# EAGLE design vest (EAGLE 6.5.0)
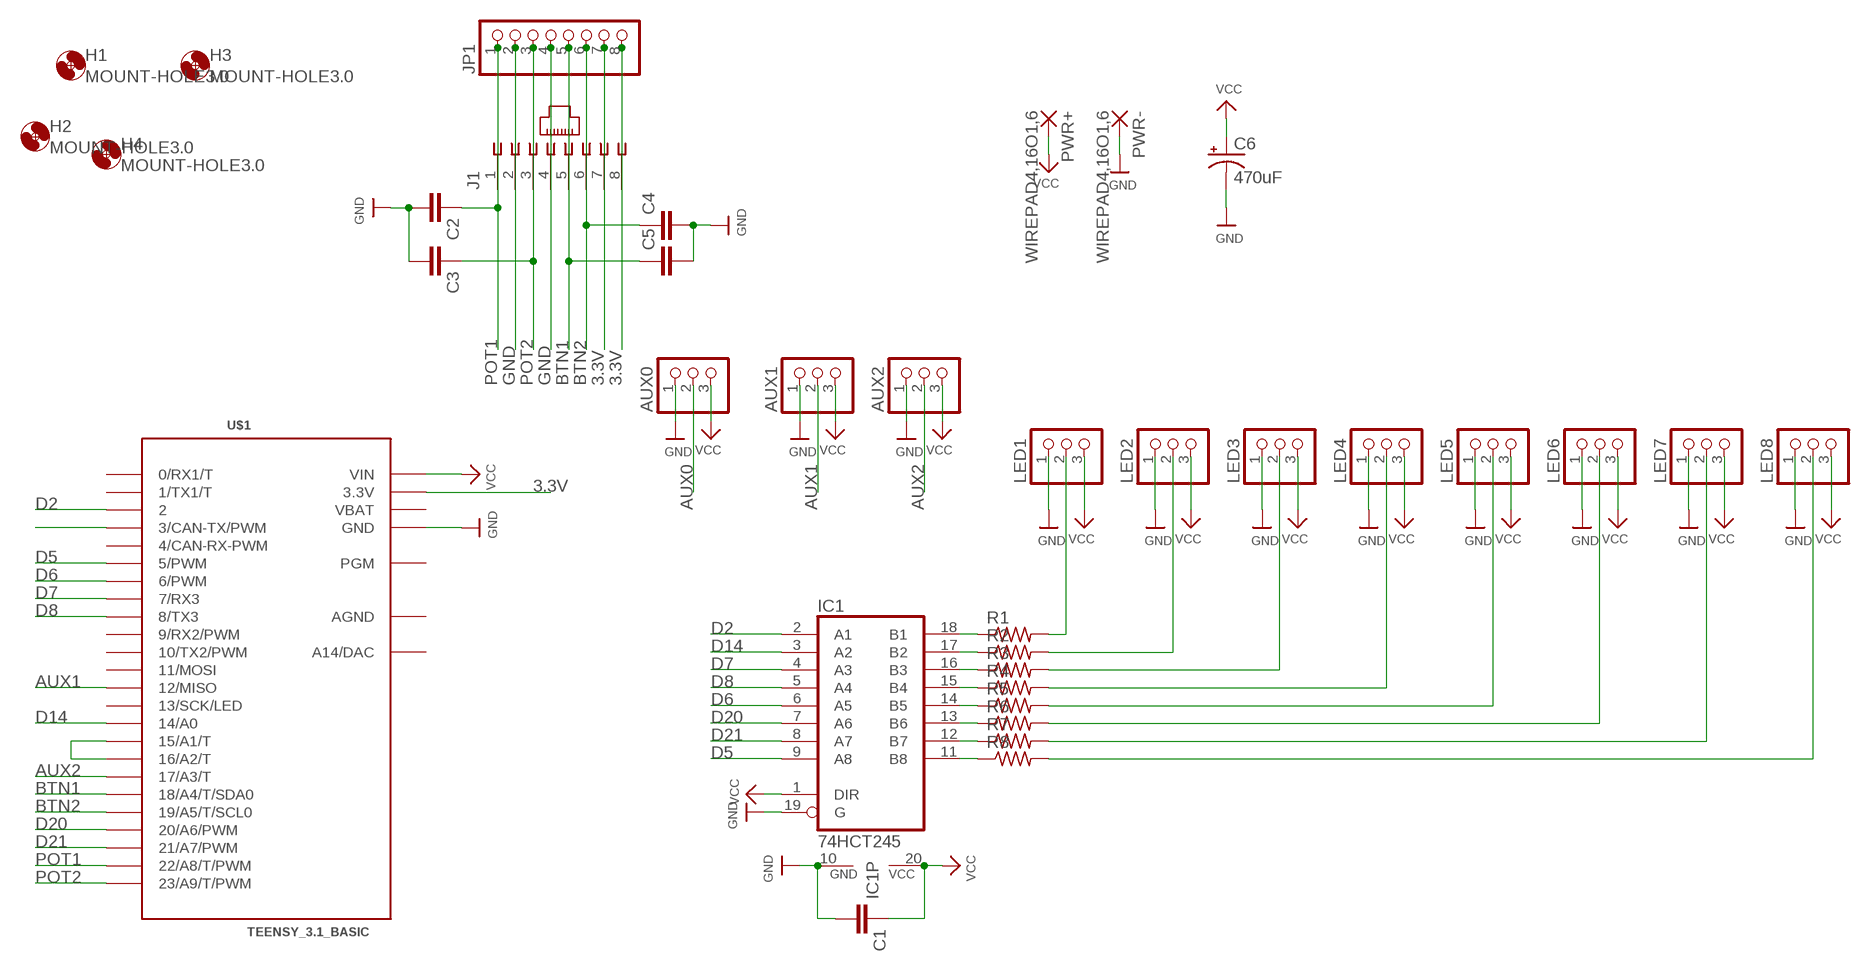
[diagram p0: schematic, sheet 1]

## Parts
AUX0  HEADER-1X3  [1X03_OVAL]
AUX1  HEADER-1X3  [1X03_OVAL]
AUX2  HEADER-1X3  [1X03_OVAL]
C1  C-EU025-025X050  [C025-025X050]
C2  C-EU025-025X050  [C025-025X050]
C3  C-EU025-025X050  [C025-025X050]
C4  C-EU025-025X050  [C025-025X050]
C5  C-EU025-025X050  [C025-025X050]
C6  470uF  CPOL-USTT2D7L  [TT2D7L]
H1  MOUNT-HOLE3.0  [3,0]
H2  MOUNT-HOLE3.0  [3,0]
H3  MOUNT-HOLE3.0  [3,0]
H4  MOUNT-HOLE3.0  [3,0]
IC1  74HCT245  74AC245N  [DIL20]
J1  215877-4  [215877-4]
JP1  HEADER-1X870MIL  [1X08_ROUND_70]
LED1  HEADER-1X3  [1X03_OVAL]
LED2  HEADER-1X3  [1X03_OVAL]
LED3  HEADER-1X3  [1X03_OVAL]
LED4  HEADER-1X3  [1X03_OVAL]
LED5  HEADER-1X3  [1X03_OVAL]
LED6  HEADER-1X3  [1X03_OVAL]
LED7  HEADER-1X3  [1X03_OVAL]
LED8  HEADER-1X3  [1X03_OVAL]
PWR+  WIREPAD4,16O1,6  [4,16O1,6]
PWR-  WIREPAD4,16O1,6  [4,16O1,6]
R1  R-US_0204/7  [0204/7]
R2  R-US_0204/7  [0204/7]
R3  R-US_0204/7  [0204/7]
R4  R-US_0204/7  [0204/7]
R5  R-US_0204/7  [0204/7]
R6  R-US_0204/7  [0204/7]
R7  R-US_0204/7  [0204/7]
R8  R-US_0204/7  [0204/7]
U$1  TEENSY_3.1_BASIC  [TEENSY_3.1_BASIC]

## Nets
3.3V: J1.7 J1.8 JP1.7 JP1.8 U$1.3.3V U$1.3.3V1(3.3V)
AUX0: AUX0.2 U$1.3(3/CAN-TX/PWM)
AUX1: AUX1.2 U$1.12(12/MISO)
AUX2: AUX2.2 U$1.17/A3(17/A3/T)
BTN1: C5.1 J1.5 JP1.5 U$1.18/A4(18/A4/T/SDA0)
BTN2: C4.1 J1.6 JP1.6 U$1.19/A5(19/A5/T/SCL0)
D2: IC1.2(A1) U$1.2
D5: IC1.9(A8) U$1.5(5/PWM)
D6: IC1.6(A5) U$1.6(6/PWM)
D7: IC1.4(A3) U$1.7(7/RX3)
D8: IC1.5(A4) U$1.8(8/TX3)
D14: IC1.3(A2) U$1.14/A0
D20: IC1.7(A6) U$1.20/A6(20/A6/PWM)
D21: IC1.8(A7) U$1.21/A7(21/A7/PWM)
GND: AUX0.1 AUX1.1 AUX2.1 C1.2 C2.2 C3.2 C4.2 C5.2 C6.- IC1.10(GND) IC1.19(G) J1.2 J1.4 JP1.2 JP1.4 LED1.1 LED2.1 LED3.1 LED4.1 LED5.1 LED6.1 LED7.1 LED8.1 PWR-.1(P) U$1.GND U$1.GND1(GND)
N$1: U$1.15/A1(15/A1/T) U$1.16/A2(16/A2/T)
N$2: IC1.11(B8) R8.1
N$3: IC1.18(B1) R1.1
N$4: IC1.17(B2) R2.1
N$5: IC1.16(B3) R3.1
N$6: IC1.15(B4) R4.1
N$7: IC1.14(B5) R5.1
N$8: IC1.13(B6) R6.1
N$9: IC1.12(B7) R7.1
N$10: LED1.2 R1.2
N$11: LED2.2 R2.2
N$12: LED3.2 R3.2
N$13: LED4.2 R4.2
N$14: LED5.2 R5.2
N$15: LED6.2 R6.2
N$16: LED7.2 R7.2
N$17: LED8.2 R8.2
POT1: C2.1 J1.1 JP1.1 U$1.22/A8(22/A8/T/PWM)
POT2: C3.1 J1.3 JP1.3 U$1.23/A9(23/A9/T/PWM)
VCC: AUX0.3 AUX1.3 AUX2.3 C1.1 C6.+ IC1.1(DIR) IC1.20(VCC) LED1.3 LED2.3 LED3.3 LED4.3 LED5.3 LED6.3 LED7.3 LED8.3 PWR+.1(P) U$1.VIN
Unconnected: U$1.0(0/RX1/T) U$1.1(1/TX1/T) U$1.4(4/CAN-RX-PWM) U$1.9(9/RX2/PWM) U$1.10(10/TX2/PWM) U$1.11(11/MOSI) U$1.13(13/SCK/LED) U$1.A14(A14/DAC) U$1.PGM

## Power pins joined to a net without a drawn wire
AGND: U$1.AGND
VBAT: U$1.VBAT

## Library data of the parts
AUX0 AUX1 AUX2 LED1-LED8 = microbuilder:HEADER-1X3: PIN HEADER
C1-C5 = rcl:C-EU: CAPACITOR, European symbol
C6 = rcl:CPOL-US: POLARIZED CAPACITOR, American symbol
H1-H4 = holes:MOUNT-HOLE: MOUNTING HOLE with drill center marker
IC1 = 74xx-eu:74*245: Octal BUS TRANSCEIVER, 3-state
J1 = con-amp:215877-4: AMP connector
JP1 = microbuilder:HEADER-1X8: PIN HEADER
PWR+ PWR- = wirepad:WIREPAD: Wire PAD connect wire on PCB
R1-R8 = rcl:R-US_: RESISTOR, American symbol
U$1 = Teensy_3_Series_Board_v1.0:TEENSY_3.1_BASIC: Footprint for Teensy 3.1 board using all pin connections on the outer perimeter

## Net classes
0 default: width 0.406 mm

## Board
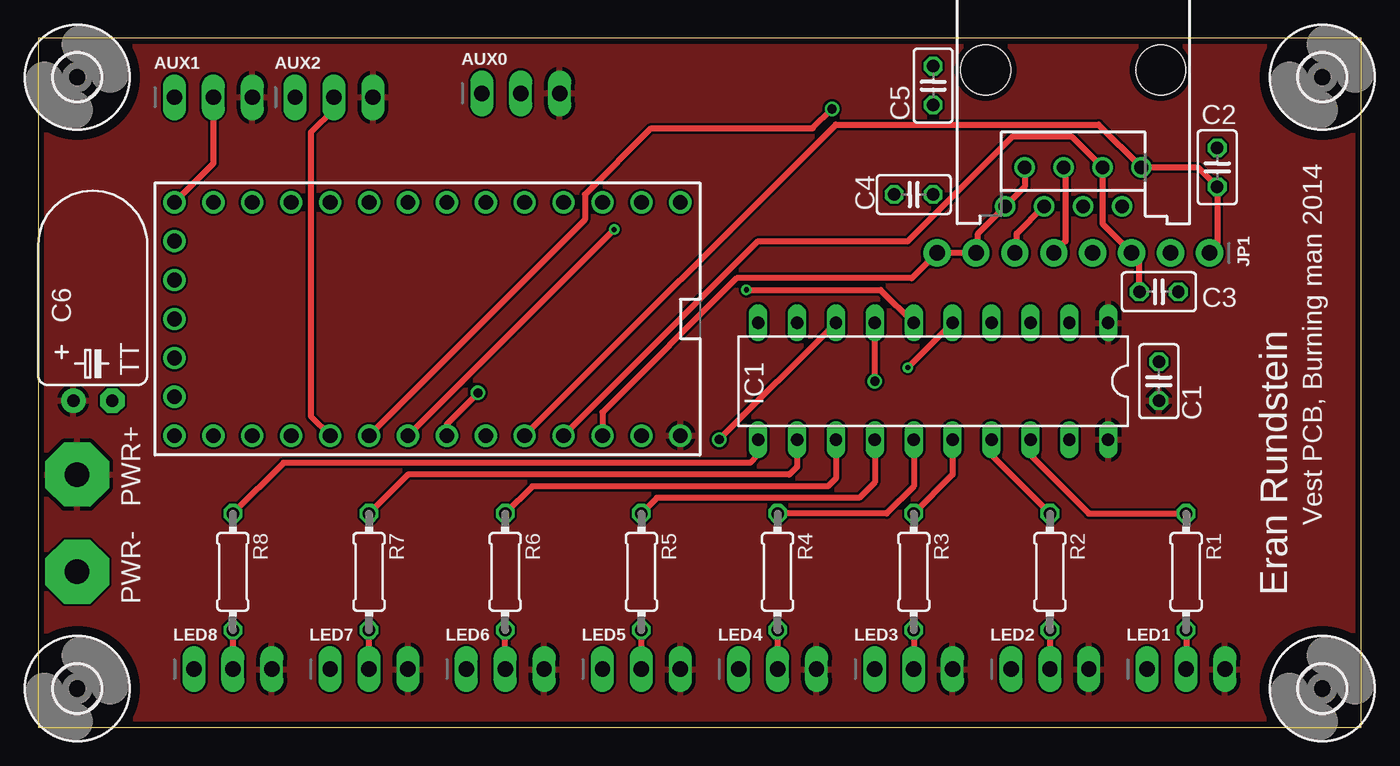
[diagram p1: board, top side]
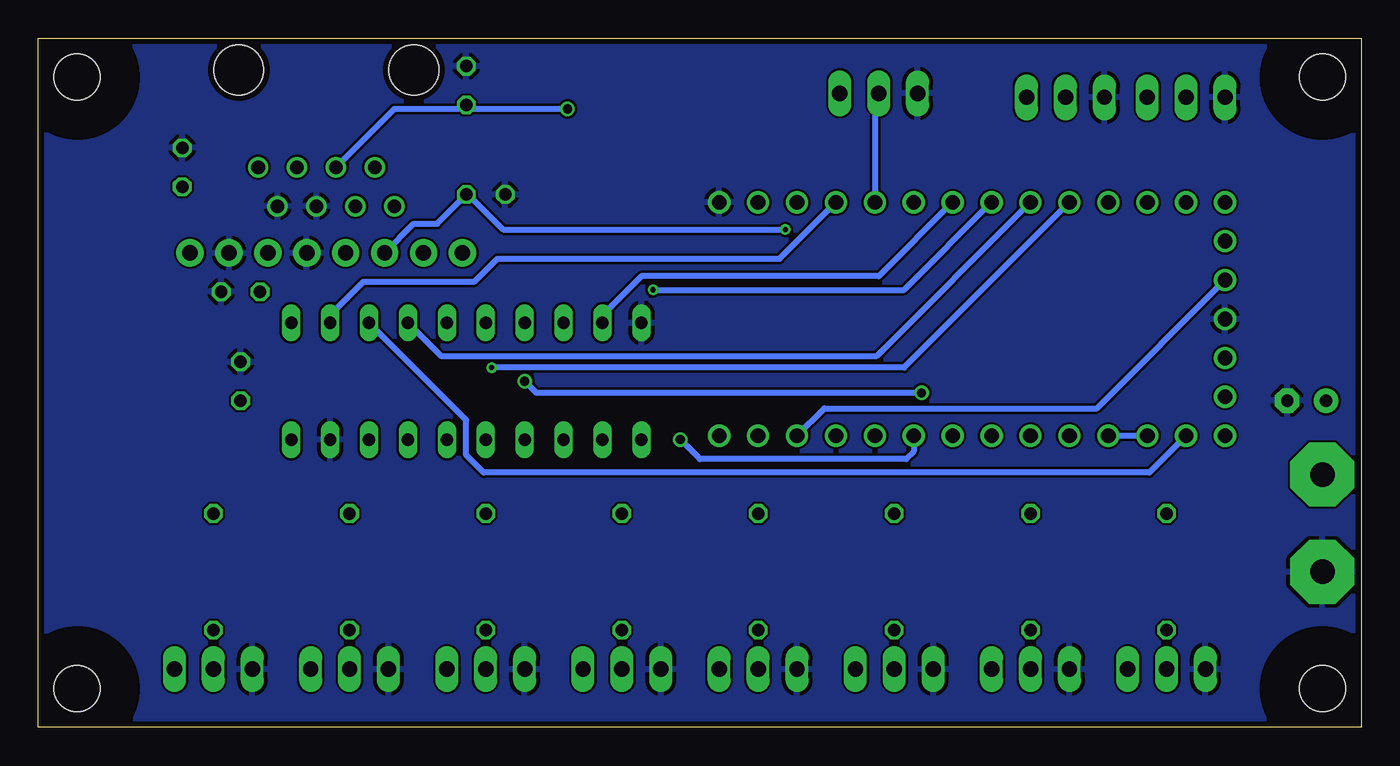
[diagram p2: board, bottom side, seen from below]

Size 86.36 x 45 mm. Coordinates in mm from the lower left corner, seen from the top.
Outline: 0,0 86.36,0 86.36,45 0,45 0,0
Copper layers (1*16): Top 0.0356mm / dielectric 1.5011mm / Bottom 0.0356mm
Design rules "oshpark_2layer": minimum track width 6mil, minimum drill 13mil, track to track 6mil, track to pad 6mil, pad to pad 6mil, via to via 6mil, smd to smd 6mil, copper to edge 15mil, drill to drill 6mil, minimum pad ring 7mil, minimum via ring 7mil, stop-mask expansion 3mil, vias tented up to drill 0mil, thermal gap 10mil

### Footprints (pad centres in the part's own frame; a part is rotated, then mirrored left to right if it is on the bottom)
1X03_OVAL = drill 1 long: 1 -2.54,0; 2 0,0; 3 2.54,0
C025-025X050 = drill 0.813 octagon: 1 -1.27,0; 2 1.27,0
TT2D7L = drill 0.813 pad 1.6: + -1.27,0 | drill 0.813 pad 1.6 octagon: - 1.27,0
3,0 = hole 3: 0,0
DIL20 = drill 0.813 long: 1 -11.43,-3.81; 2 -8.89,-3.81; 3 -6.35,-3.81; 4 -3.81,-3.81; 5 -1.27,-3.81; 6 1.27,-3.81; 7 3.81,-3.81; 8 6.35,-3.81; 9 8.89,-3.81; 10 11.43,-3.81; 11 11.43,3.81; 12 8.89,3.81; 13 6.35,3.81; 14 3.81,3.81; 15 1.27,3.81; 16 -1.27,3.81; 17 -3.81,3.81; 18 -6.35,3.81; 19 -8.89,3.81; 20 -11.43,3.81
215877-4 = drill 0.889: 1 -4.445,6.35; 2 -3.175,8.89; 3 -1.905,6.35; 4 -0.635,8.89; 5 0.635,6.35; 6 1.905,8.89; 7 3.175,6.35; 8 4.445,8.89 | hole 3.251: -5.715,0; 5.715,0
1X08_ROUND_70 = drill 1 pad 1.778: 1 -8.89,0; 2 -6.35,0; 3 -3.81,0; 4 -1.27,0; 5 1.27,0; 6 3.81,0; 7 6.35,0; 8 8.89,0
4,16O1,6 = drill 1.6 pad 4.166 octagon: 1 0,0
0204/7 = drill 0.813 octagon: 1 -3.81,0; 2 3.81,0
TEENSY_3.1_BASIC = drill 0.965: 0 -7.62,13.97; 1 -7.62,11.43; 2 -7.62,8.89; 3 -7.62,6.35; 3.3V 7.62,11.43; 3.3V1 -2.54,-16.51; 4 -7.62,3.81; 5 -7.62,1.27; 6 -7.62,-1.27; 7 -7.62,-3.81; 8 -7.62,-6.35; 9 -7.62,-8.89; 10 -7.62,-11.43; 11 -7.62,-13.97; 12 -7.62,-16.51; 13 7.62,-16.51; 14/A0 7.62,-13.97; 15/A1 7.62,-11.43; 16/A2 7.62,-8.89; 17/A3 7.62,-6.35; 18/A4 7.62,-3.81; 19/A5 7.62,-1.27; 20/A6 7.62,1.27; 21/A7 7.62,3.81; 22/A8 7.62,6.35; 23/A9 7.62,8.89; A14 5.08,-16.51; AGND 7.62,13.97; GND -7.62,16.51; GND1 0,-16.51; PGM 2.54,-16.51; VBAT -5.08,-16.51; VIN 7.62,16.51

### Placement (x,y rotation side)
AUX0  31.5,41.4 0 top
AUX1  11.43,41.15 0 top
AUX2  19.3,41.15 0 top
C1  73.15,22.61 90 top
C2  76.96,36.58 90 top
C3  73.15,28.45 0 top
C4  57.15,34.8 180 top
C5  58.42,41.91 90 top
C6  3.56,21.34 0 top
H1  2.54,2.54 0 top
H2  83.82,42.46 0 top
H3  2.54,42.46 0 top
H4  83.82,2.54 0 top
IC1  58.42,22.61 180 top
J1  67.56,42.93 180 top
JP1  67.56,30.99 180 top
LED1  74.93,3.81 0 top
LED2  66.04,3.81 0 top
LED3  57.15,3.81 0 top
LED4  48.26,3.81 0 top
LED5  39.37,3.81 0 top
LED6  30.48,3.81 0 top
LED7  21.59,3.81 0 top
LED8  12.7,3.81 0 top
PWR+  2.54,16.51 0 top
PWR-  2.54,10.16 0 top
R1  74.93,10.16 270 top
R2  66.04,10.16 270 top
R3  57.15,10.16 270 top
R4  48.26,10.16 270 top
R5  39.37,10.16 270 top
R6  30.48,10.16 270 top
R7  21.59,10.16 270 top
R8  12.7,10.16 270 top
U$1  25.4,26.67 270 top

### Tracks (layer width: path | path; a pad name or v marks a point on that pad's centre or on a via)
3.3V
  Top 0.406: J1.7 64.39,35.31 J1.8 61.34,32.26 61.34,31.11 JP1.7 JP1.8 57.02,29.34 45.59,29.34 36.83,20.57 U$1.3.3V
  Bottom 0.406: U$1.3.3V1 17.27,20.83 35.05,20.83 U$1.3.3V
AUX0
  Bottom 0.406: AUX0.2 31.75,41.15 U$1.3
AUX1
  Top 0.406: U$1.12 11.43,36.83 AUX1.2
AUX2
  Top 0.406: U$1.17/A3 17.78,20.32 17.78,38.86 19.3,40.39 AUX2.2
BTN1  (via drill 0.6)
  Top 0.406: U$1.18/A4 35.69,33.15 35.69,34.8 40.01,39.12 50.55,39.12 v51.82,40.39 | JP1.5 67.06,31.75 67.06,36.45 J1.5
  Bottom 0.406: 65.28,38.23 J1.5 63.12,40.39 58.67,40.39 | v51.82,40.39 58.67,40.39 | C5.1 58.67,40.39
BTN2  (via drill 0.33)
  Top 0.406: J1.6 63.88,32.26 63.88,31.11 JP1.6 | v37.59,32.51 U$1.19/A5
  Bottom 0.406: JP1.6 61.85,32.89 60.33,32.89 C4.1 58.29,34.67 58.17,34.67 56.01,32.51 v37.59,32.51
D2
  Bottom 0.406: IC1.2 67.31,27.3 66.93,27.3 65.15,29.08 57.91,29.08 56.39,30.61 37.97,30.61 36.83,31.75 36.58,32 U$1.2
D5
  Bottom 0.406: IC1.9 49.53,27.3 49.15,27.3 46.99,29.46 31.5,29.46 U$1.5
D6  (via drill 0.33)
  Top 0.406: IC1.6 54.99,28.57 v46.23,28.57
  Bottom 0.406: U$1.6 29.84,28.57 v46.23,28.57
D7
  Bottom 0.406: IC1.4 60.07,24.26 31.62,24.26 U$1.7
D8  (via drill 0.33)
  Top 0.406: v56.77,23.5 IC1.5
  Bottom 0.406: v56.77,23.5 29.84,23.5 U$1.8
D14
  Bottom 0.406: IC1.3 58.42,20.07 58.42,17.78 57.28,16.64 13.84,16.64 U$1.14/A0
D20  (via drill 0.6)
  Top 0.406: U$1.20/A6 26.67,19.81 v28.7,21.84 | v54.61,22.61 IC1.7
  Bottom 0.406: v28.7,21.84 53.85,21.84 v54.61,22.61
D21  (via drill 0.6)
  Top 0.406: v44.45,18.8 IC1.8
  Bottom 0.406: U$1.21/A7 29.21,18.03 29.72,17.53 43.18,17.53 v44.45,18.8
GND
  pour Bottom: 0.25,0.25 86.11,0.25 86.11,44.48 0.25,44.48
N$1
  Bottom 0.406: U$1.16/A2 U$1.15/A1
N$2
  Top 0.406: IC1.11 46.99,17.78 46.48,17.27 16,17.27 R8.1
N$3
  Top 0.406: IC1.18 64.77,17.78 68.58,13.97 R1.1
N$4
  Top 0.406: IC1.17 62.23,17.78 R2.1
N$5
  Top 0.406: IC1.16 59.69,16.51 R3.1
N$6
  Top 0.406: IC1.15 57.15,15.75 55.37,13.97 R4.1
N$7
  Top 0.406: IC1.14 54.61,16 53.59,14.99 40.39,14.99 R5.1
N$8
  Top 0.406: IC1.13 52.07,16.26 51.56,15.75 32.26,15.75 R6.1
N$9
  Top 0.406: IC1.12 49.53,17.02 49.02,16.51 24.13,16.51 R7.1
N$10
  Top 0.406: R1.2 LED1.2
N$11
  Top 0.406: R2.2 LED2.2
N$12
  Top 0.406: R3.2 LED3.2
N$13
  Top 0.406: R4.2 LED4.2
N$14
  Top 0.406: LED5.2 R5.2
N$15
  Top 0.406: LED6.2 R6.2
N$16
  Top 0.406: LED7.2 R7.2
N$17
  Top 0.406: R8.2 LED8.2
POT1
  Top 0.406: U$1.22/A8 52.07,39.37 69.22,39.37 J1.1 75.69,36.58 C2.1 76.96,31.5 JP1.1 76.58,31.11
POT2
  Top 0.406: U$1.23/A9 46.99,31.75 56.77,31.75 63.63,38.61 67.44,38.61 J1.3 69.47,32.89 JP1.3 71.88,30.48 C3.1
VCC
  pour Top: 0.25,0.25 86.11,0.25 86.11,44.48 0.25,44.48

### Text on the board
tPlace: Vest PCB, Burning man 2014 | Eran Rundstein